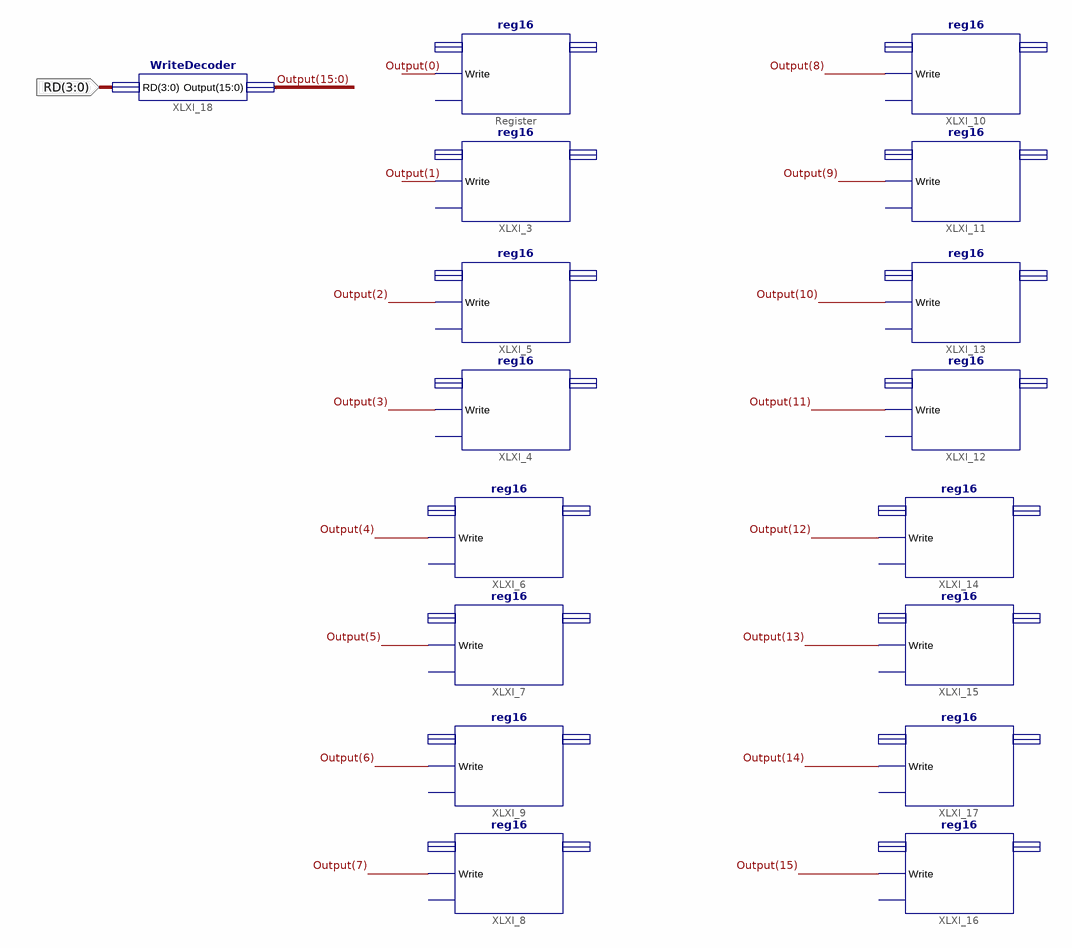
[diagram p0: schematic sheet 1]
// Xilinx ISE schematic RegisterFile.sch (spartan3e) as structural Verilog: 17 symbols, 1 ports
module RegisterFile (
  input  [3:0] RD
);

  wire [15:0] Output;

  reg16 Register (.Write(Output[0]));  // open: I, CLK, O
  reg16 XLXI_3 (.Write(Output[1]));  // open: I, CLK, O
  reg16 XLXI_4 (.Write(Output[3]));  // open: I, CLK, O
  reg16 XLXI_5 (.Write(Output[2]));  // open: I, CLK, O
  reg16 XLXI_6 (.Write(Output[4]));  // open: I, CLK, O
  reg16 XLXI_7 (.Write(Output[5]));  // open: I, CLK, O
  reg16 XLXI_8 (.Write(Output[7]));  // open: I, CLK, O
  reg16 XLXI_9 (.Write(Output[6]));  // open: I, CLK, O
  reg16 XLXI_10 (.Write(Output[8]));  // open: I, CLK, O
  reg16 XLXI_11 (.Write(Output[9]));  // open: I, CLK, O
  reg16 XLXI_12 (.Write(Output[11]));  // open: I, CLK, O
  reg16 XLXI_13 (.Write(Output[10]));  // open: I, CLK, O
  reg16 XLXI_14 (.Write(Output[12]));  // open: I, CLK, O
  reg16 XLXI_15 (.Write(Output[13]));  // open: I, CLK, O
  reg16 XLXI_16 (.Write(Output[15]));  // open: I, CLK, O
  reg16 XLXI_17 (.Write(Output[14]));  // open: I, CLK, O
  WriteDecoder XLXI_18 (.RD(RD), .Output(Output));
endmodule
